# EAGLE design stEEG (EAGLE 9.3.0)

## Sheet 1 of 2
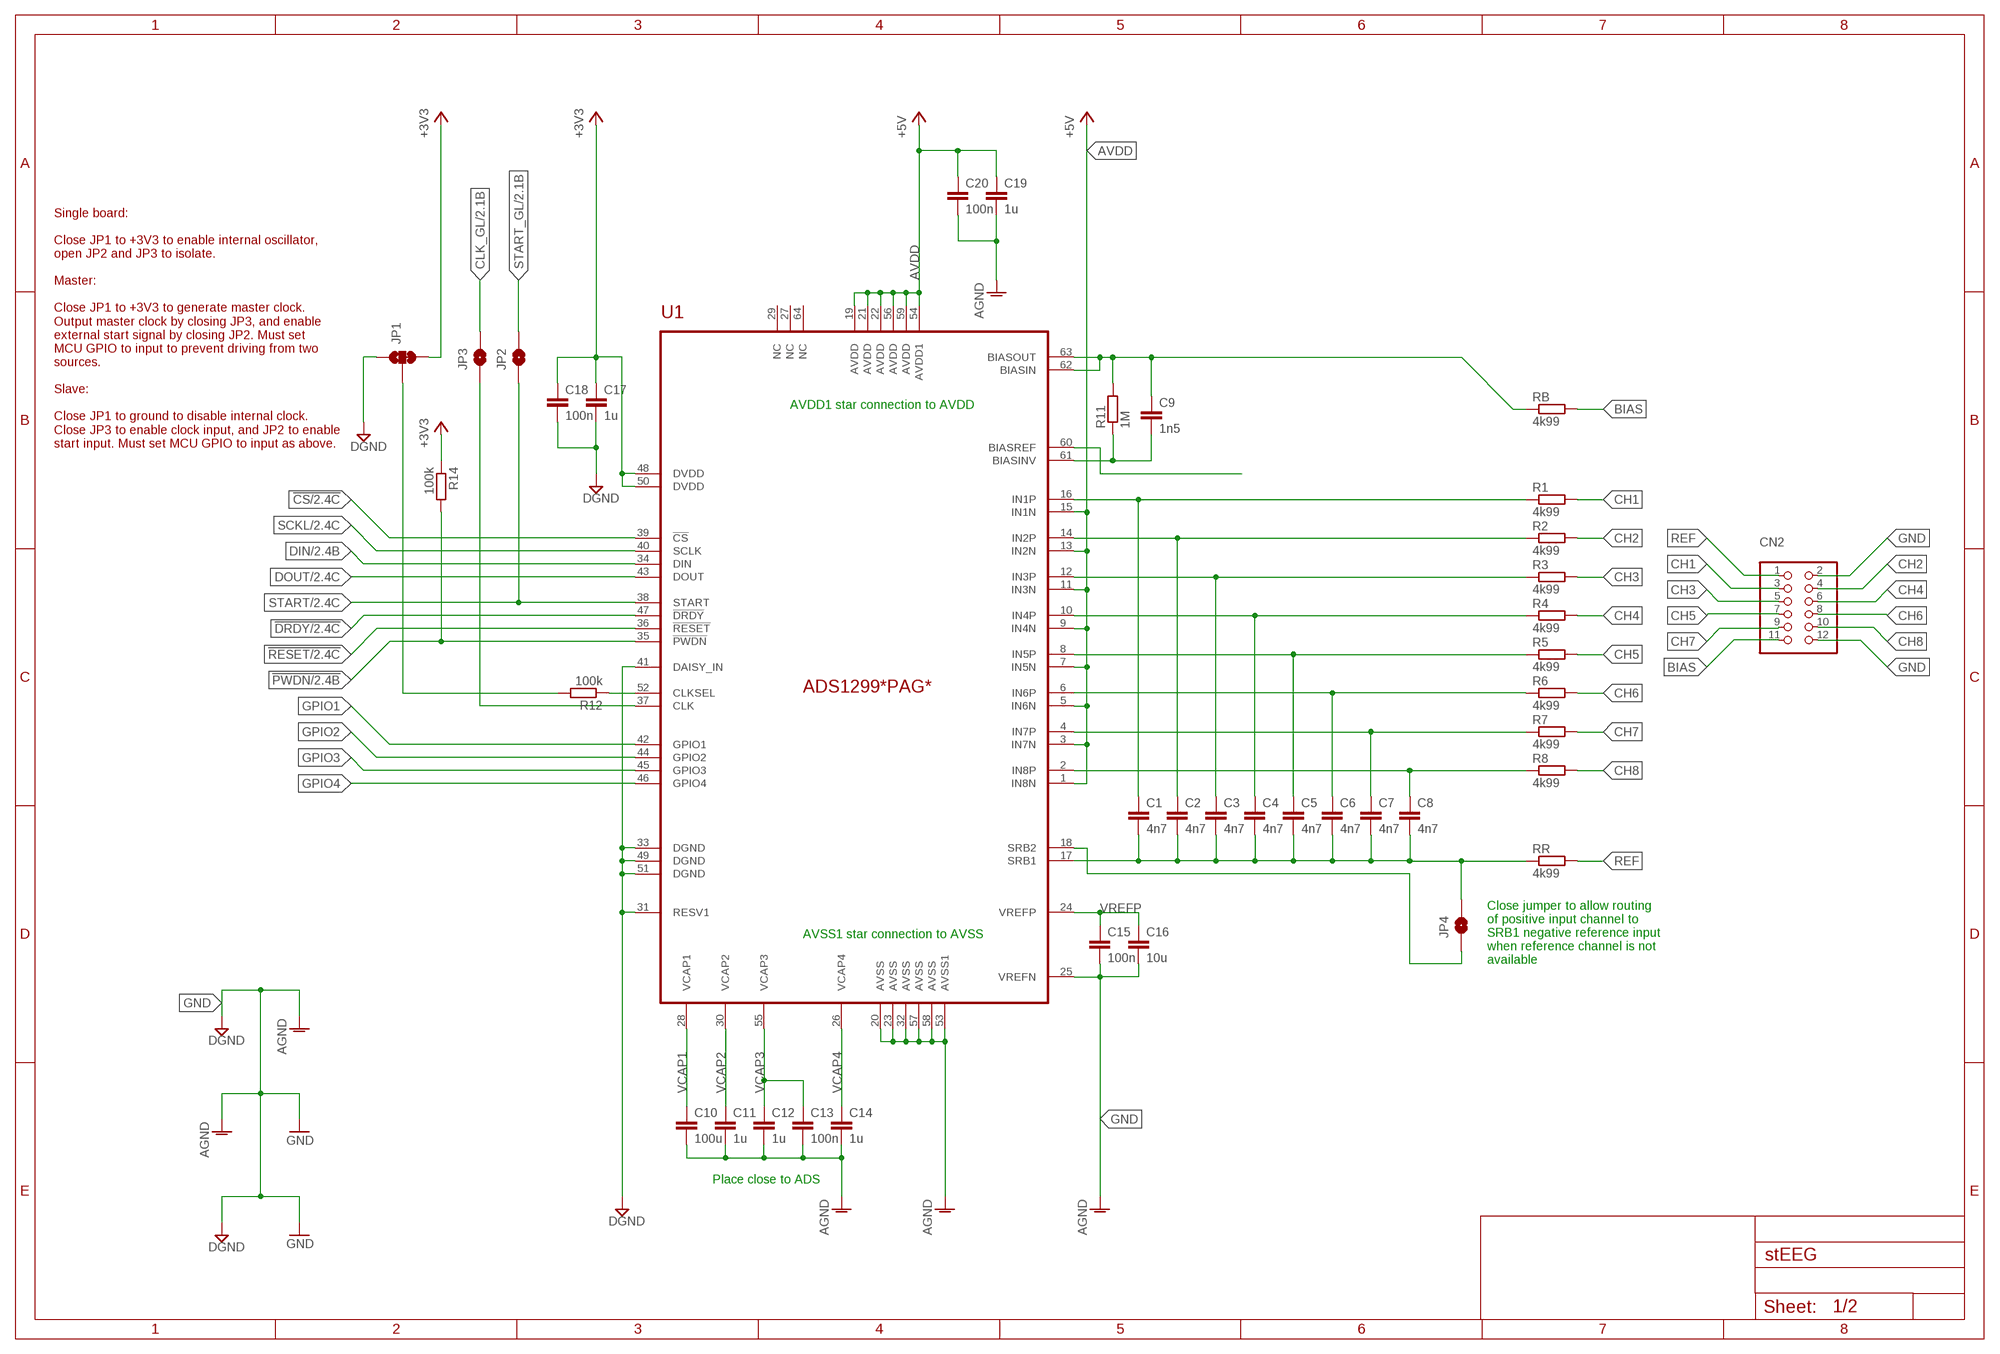
[diagram p0: schematic, sheet 1]

### Parts
C1  4n7  C-EUC0402  [C0402]
C2  4n7  C-EUC0402  [C0402]
C3  4n7  C-EUC0402  [C0402]
C4  4n7  C-EUC0402  [C0402]
C5  4n7  C-EUC0402  [C0402]
C6  4n7  C-EUC0402  [C0402]
C7  4n7  C-EUC0402  [C0402]
C8  4n7  C-EUC0402  [C0402]
C9  1n5  C-EUC0402  [C0402]
C10  100u  C-EUC1206  [C1206]
C11  1u  C-EUC0603  [C0603]
C12  1u  C-EUC0603  [C0603]
C13  100n  C-EUC0402  [C0402]
C14  1u  C-EUC0603  [C0603]
C15  100n  C-EUC0402  [C0402]
C16  10u  C-EUC0603  [C0603]
C17  1u  C-EUC0603  [C0603]
C18  100n  C-EUC0402  [C0402]
C19  1u  C-EUC0603  [C0603]
C20  100n  C-EUC0402  [C0402]
CN2  PINHD-2X6/90  [2X06/90]
JP1  JUMPER-SMT_3_1-NC_TRACE_SILK  [SMT-JUMPER_3_1-NC_TRACE_SILK]
JP2  JUMPER-SMT_2_NO_SILK  [SMT-JUMPER_2_NO_SILK]
JP3  JUMPER-SMT_2_NO_SILK  [SMT-JUMPER_2_NO_SILK]
JP4  JUMPER-SMT_2_NO_SILK  [SMT-JUMPER_2_NO_SILK]
R1  4k99  R-EU_R0402  [R0402]
R2  4k99  R-EU_R0402  [R0402]
R3  4k99  R-EU_R0402  [R0402]
R4  4k99  R-EU_R0402  [R0402]
R5  4k99  R-EU_R0402  [R0402]
R6  4k99  R-EU_R0402  [R0402]
R7  4k99  R-EU_R0402  [R0402]
R8  4k99  R-EU_R0402  [R0402]
R11  1M  R-EU_R0402  [R0402]
R12  100k  R-EU_R0402  [R0402]
R14  100k  R-EU_R0402  [R0402]
RB  4k99  R-EU_R0402  [R0402]
RR  4k99  R-EU_R0402  [R0402]
U1  ADS1299*PAG*  [PAG-PQFP64]

### Nets
!CS: U1.39(!CS) ; also sheet 2
!DRDY: U1.47(!DRDY) ; also sheet 2
!PWDN: R14.2 U1.35(!PWDN) ; also sheet 2
!RESET: U1.36(!RESET) ; also sheet 2
+3V3: C17.1 C18.1 JP1.3 R14.1 U1.48(DVDD) U1.50(DVDD) ; also sheet 2
AVDD: C19.1 C20.1 U1.1(IN8N) U1.3(IN7N) U1.5(IN6N) U1.7(IN5N) U1.9(IN4N) U1.11(IN3N) U1.13(IN2N) U1.15(IN1N) U1.19(AVDD) U1.21(AVDD) U1.22(AVDD) U1.54(AVDD1) U1.56(AVDD) U1.59(AVDD) ; supply symbol labelled +5V ; also sheet 2
BIAS: CN2.11 RB.2
CH1: CN2.3 R1.2
CH2: CN2.4 R2.2
CH3: CN2.5 R3.2
CH4: CN2.6 R4.2
CH5: CN2.7 R5.2
CH6: CN2.8 R6.2
CH7: CN2.9 R7.2
CH8: CN2.10 R8.2
CLK_GL: JP3.2 ; also sheet 2
DIN: U1.34(DIN) ; also sheet 2
DOUT: U1.43(DOUT) ; also sheet 2
GND: C10.2 C11.2 C12.2 C13.2 C14.2 C15.2 C16.2 C17.2 C18.2 C19.2 C20.2 CN2.2 CN2.12 JP1.1 U1.20(AVSS) U1.23(AVSS) U1.25(VREFN) U1.31(RESV1) U1.32(AVSS) U1.33(DGND) U1.41(DAISY_IN) U1.49(DGND) U1.51(DGND) U1.53(AVSS1) U1.57(AVSS) U1.58(AVSS) ; supply symbol labelled DGND, AGND ; also sheet 2
GPIO1: U1.42(GPIO1)
GPIO2: U1.44(GPIO2)
GPIO3: U1.45(GPIO3)
GPIO4: U1.46(GPIO4)
N$1: C1.1 R1.1 U1.16(IN1P)
N$2: R12.1 U1.52(CLKSEL)
N$3: C3.1 R3.1 U1.12(IN3P)
N$4: C4.1 R4.1 U1.10(IN4P)
N$5: C9.2 R11.1 U1.61(BIASINV)
N$6: C6.1 R6.1 U1.6(IN6P)
N$7: C7.1 R7.1 U1.4(IN7P)
N$10: C9.1 R11.2 RB.1 U1.62(BIASIN) U1.63(BIASOUT)
N$11: C2.1 R2.1 U1.14(IN2P)
N$14: C5.1 R5.1 U1.8(IN5P)
N$17: C8.1 R8.1 U1.2(IN8P)
N$19: U1.60(BIASREF)
N$20: JP4.1 U1.18(SRB2)
N$21: JP1.2 R12.2
N$22: JP3.1 U1.37(CLK)
REF: CN2.1 RR.2
SCKL: U1.40(SCLK) ; also sheet 2
START: JP2.1 U1.38(START) ; also sheet 2
START_GL: JP2.2 ; also sheet 2
VCAP1: C10.1 U1.28(VCAP1)
VCAP2: C11.1 U1.30(VCAP2)
VCAP3: C12.1 C13.1 U1.55(VCAP3)
VCAP4: C14.1 U1.26(VCAP4)
VREFP: C15.1 C16.1 U1.24(VREFP)
VREFX: C1.2 C2.2 C3.2 C4.2 C5.2 C6.2 C7.2 C8.2 JP4.2 RR.1 U1.17(SRB1)
Unconnected: U1.27(NC) U1.29(NC) U1.64(NC)

### Notes on the sheet
- AVDD1 star connection to AVDD
- Single board:
  
  Close JP1 to +3V3 to enable internal oscillator,
  open JP2 and JP3 to isolate.
  
  Master:
  
  Close JP1 to +3V3 to generate master clock. 
  Output master clock by closing JP3, and enable
  external start signal by closing JP2. Must set
  MCU GPIO to input to prevent driving from two
  sources.
  
  Slave:
  
  Close JP1 to ground to disable internal clock.
  Close JP3 to enable clock input, and JP2 to enable
  start input. Must set MCU GPIO to input as above.
- AVSS1 star connection to AVSS
- Close jumper to allow routing
  of positive input channel to
  SRB1 negative reference input
  when reference channel is not
  available
- Place close to ADS

## Sheet 2 of 2
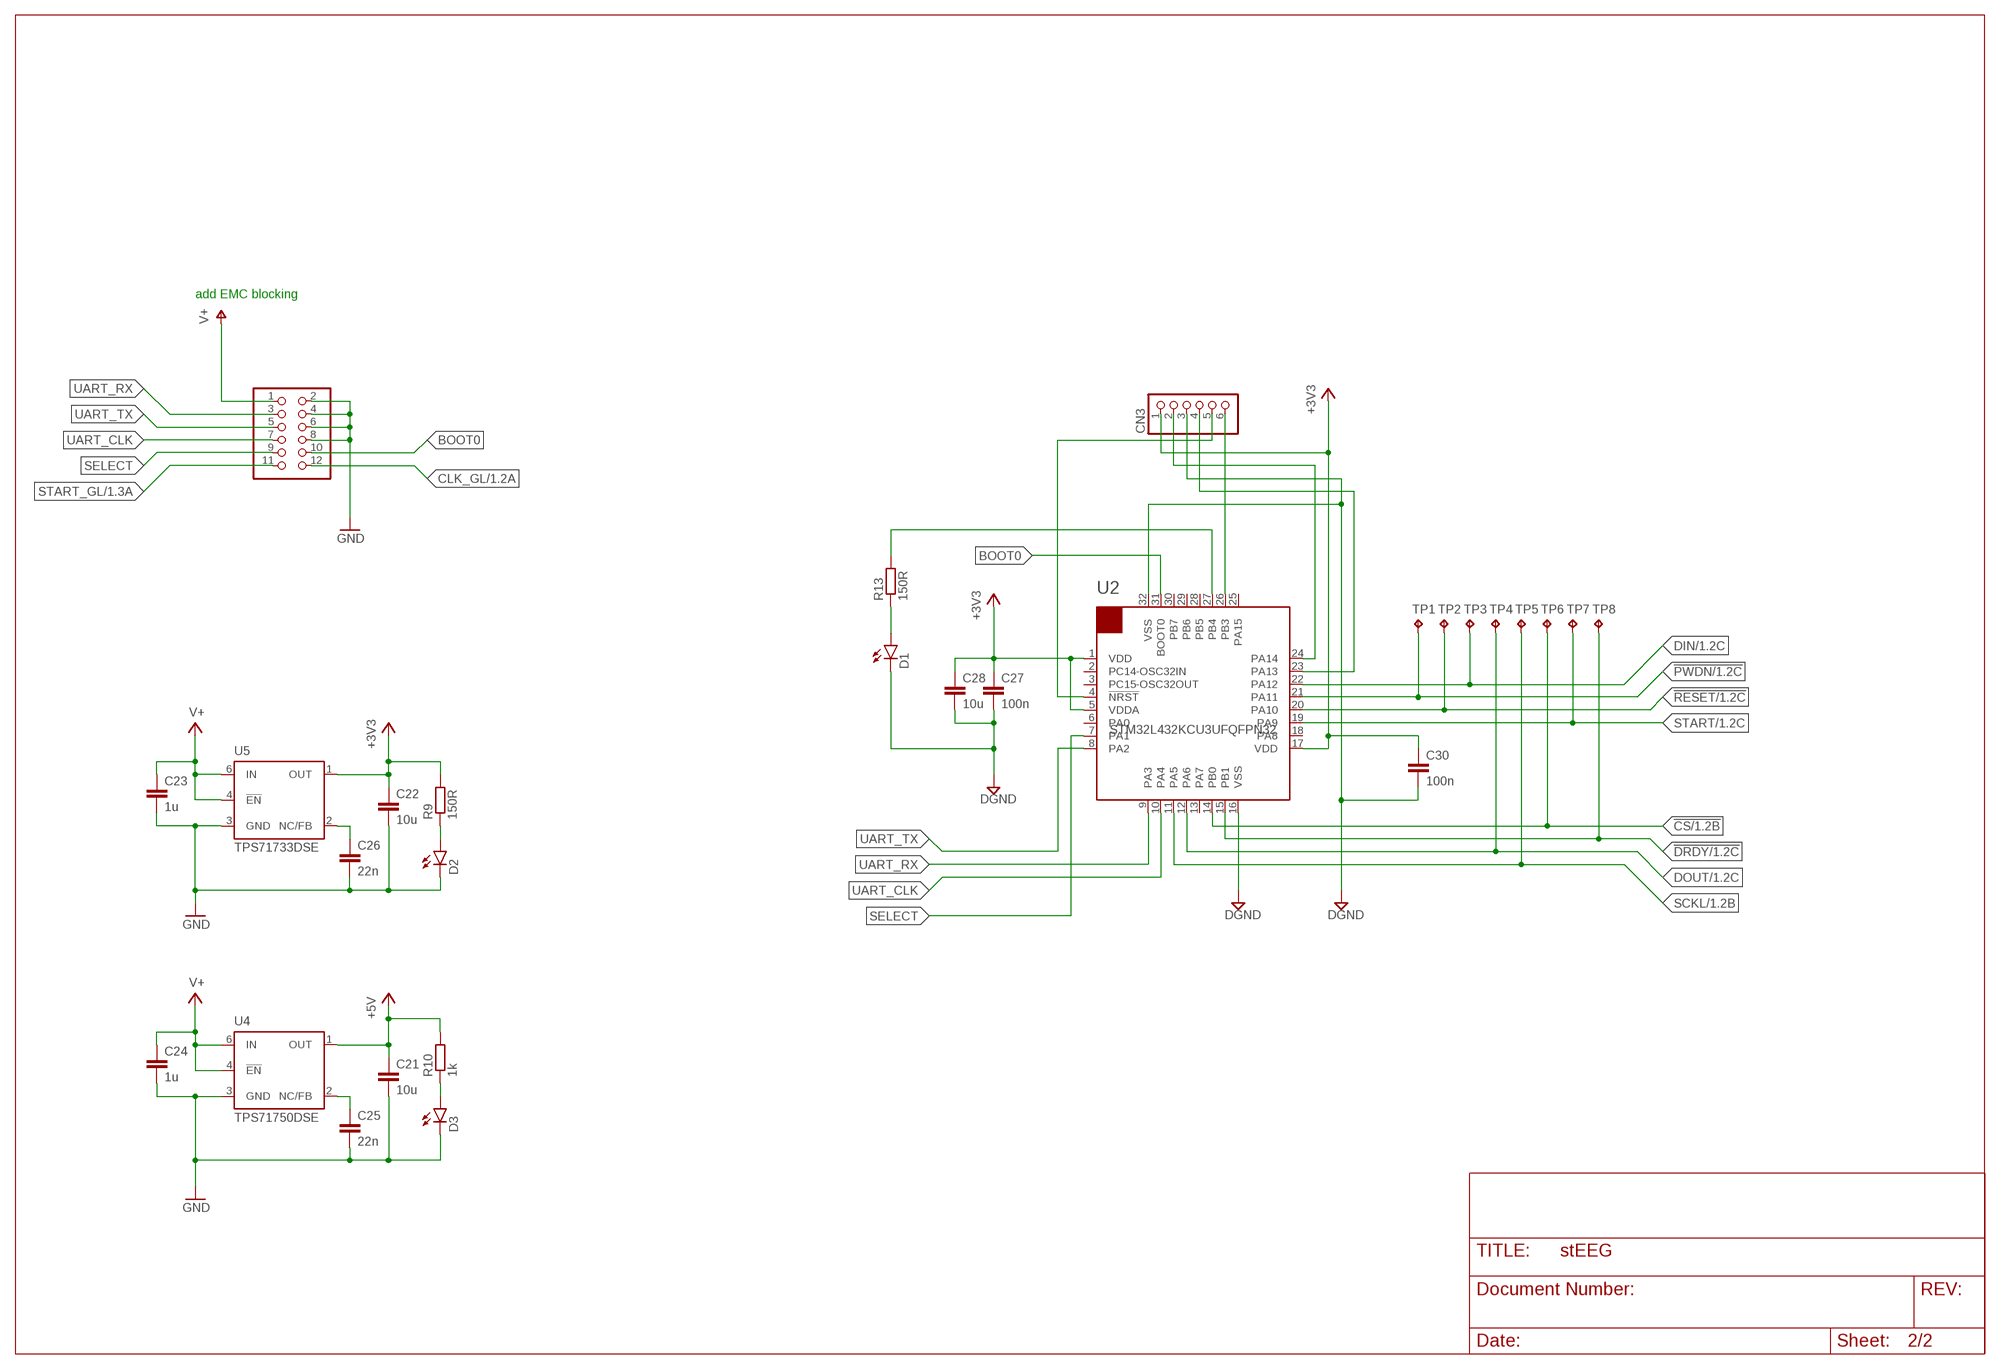
[diagram p1: schematic, sheet 2]

### Parts
C21  10u  C-EUC0805  [C0805]
C22  10u  C-EUC0805  [C0805]
C23  1u  C-EUC0603  [C0603]
C24  1u  C-EUC0603  [C0603]
C25  22n  C-EUC0402  [C0402]
C26  22n  C-EUC0402  [C0402]
C27  100n  C-EUC0402  [C0402]
C28  10u  C-EUC0603  [C0603]
C30  100n  C-EUC0402  [C0402]
CN1  PINHD-2X6/90  [2X06/90]
CN3  PINHD-1X6  [1X06]
D1  LED0603  [CHIP-LED0603]
D2  LED0603  [CHIP-LED0603]
D3  LED0603  [CHIP-LED0603]
R9  150R  R-EU_R0402  [R0402]
R10  1k  R-EU_R0402  [R0402]
R13  150R  R-EU_R0402  [R0402]
TP1  TPTP10R  [TP10R]
TP2  TPTP10R  [TP10R]
TP3  TPTP10R  [TP10R]
TP4  TPTP10R  [TP10R]
TP5  TPTP10R  [TP10R]
TP6  TPTP10R  [TP10R]
TP7  TPTP10R  [TP10R]
TP8  TPTP10R  [TP10R]
U2  STM32L432KCU3UFQFPN32  [QFN50P500X500X60-32]
U4  TPS71750DSE  [WSON-DSE]
U5  TPS71733DSE  [WSON-DSE]

### Nets
!CS: TP6.TP U2.14(PB0) ; also sheet 1
!DRDY: TP8.TP U2.15(PB1) ; also sheet 1
!PWDN: TP1.TP U2.21(PA11) ; also sheet 1
!RESET: TP2.TP U2.20(PA10) ; also sheet 1
+3V3: C22.1 C27.1 C28.1 C30.1 CN3.1 R9.2 U2.1(VDD) U2.5(VDDA) U2.17(VDD) U5.1(OUT) ; also sheet 1
AVDD: C21.1 R10.2 U4.1(OUT) ; supply symbol labelled +5V ; also sheet 1
BOOT0: CN1.10 U2.31(BOOT0)
CLK_GL: CN1.12 ; also sheet 1
DIN: TP3.TP U2.22(PA12) ; also sheet 1
DOUT: TP4.TP U2.12(PA6) ; also sheet 1
GND: C21.2 C22.2 C23.2 C24.2 C25.2 C26.2 C27.2 C28.2 C30.2 CN1.2 CN1.4 CN1.6 CN1.8 CN3.3 D1.C D2.C D3.C U2.16(VSS) U2.32(VSS) U4.3(GND) U5.3(GND) ; supply symbol labelled DGND ; also sheet 1
N$9: D1.A R13.1
N$12: CN3.4 U2.23(PA13)
N$13: C26.1 U5.2(NC/FB)
N$15: CN3.2 U2.24(PA14)
N$16: CN3.6 U2.26(PB3)
N$18: CN3.5 U2.4(!NRST)
N$23: D2.A R9.1
N$24: R13.2 U2.27(PB4)
N$26: D3.A R10.1
N$31: C25.1 U4.2(NC/FB)
SCKL: TP5.TP U2.11(PA5) ; also sheet 1
SELECT: CN1.9 U2.7(PA1)
START: TP7.TP U2.19(PA9) ; also sheet 1
START_GL: CN1.11 ; also sheet 1
UART_CLK: CN1.7 U2.10(PA4)
UART_RX: CN1.3 U2.9(PA3)
UART_TX: CN1.5 U2.8(PA2)
V+: C23.1 C24.1 CN1.1 U4.4(!EN) U4.6(IN) U5.4(!EN) U5.6(IN)
Unconnected: U2.2(PC14-OSC32IN) U2.3(PC15-OSC32OUT) U2.6(PA0) U2.13(PA7) U2.18(PA8) U2.25(PA15) U2.28(PB5) U2.29(PB6) U2.30(PB7)

### Notes on the sheet
- add EMC blocking

## Library data of the parts
C1-C28 C30 = rclc:C-EU: CAPACITOR, European symbol; SPICEPREFIX: C
CN1 CN2 = pinhead:PINHD-2X6: PIN HEADER
CN3 = pinhead:PINHD-1X6: PIN HEADER
D1-D3 = LED:LED: LED OSRAM: - CHIPLED LG R971, LG N971, LY N971, LG Q971, LY Q971, LO R971, LY R971 LH N974, LH R974 LS Q976, LO Q976, LY Q976 LO Q996 - Hyper CHIPLED LW Q18S LB Q993, LB Q99A, LB R99A - SideLED LS A670, LO A670, LY A670, LG A670, LP A670 LB A673, LV A673, LT A673, LW A673 LH A674 LY A675 LS A676, LA A676, LO A676, LY A676, LW A676 LS A679, LY A679, LG A679 - Hyper Micro SIDELED® LS Y876, LA Y876, LO Y876, LY Y876 LT Y87S - SmartLED LW L88C, LW L88S LB L89C, LB L89S, LG L890 LS L89K, LO L89K, LY L89K LS L896, LA L896, LO L896, LY L896 - TOPLED LS T670, LO T670, LY T670, LG T670, LP T670 LSG T670, LSP T670, LSY T670, LOP T670, LYG T670 LG T671, LOG T671, LSG T671 LB T673, LV T673, LT T673, LW T673 LH T674 LS T676, LA T676, LO T676, LY T676, LB T676, LH T676, LSB T676, LW T676 LB T67C, LV T67C, LT T67C, LS T67K, LO T67K, LY T67K, LW E67C LS E67B, LA E67B, LO E67B, LY E67B, LB E67C, LV E67C, LT E67C LW T67C LS T679, LY T679, LG T679 LS T770, LO T770, LY T770, LG T770, LP T770 LB T773, LV T773, LT T773, LW T773 LH T774 LS E675, LA E675, LY E675, LS T675 LS T776, LA T776, LO T776, LY T776, LB T776 LHGB T686 LT T68C, LB T68C - Hyper Mini TOPLED® LB M676 - Mini TOPLED Santana® LG M470 LS M47K, LO M47K, LY M47K Source: http://www.osram.convergy.de LUXEON: - LUMILED® LXK2-PW12-R00, LXK2-PW12-S00, LXK2-PW14-U00, LXK2-PW14-V00 LXK2-PM12-R00, LXK2-PM12-S00, LXK2-PM14-U00 LXK2-PE12-Q00, LXK2-PE12-R00, LXK2-PE12-S00, LXK2-PE14-T00, LXK2-PE14-U00 LXK2-PB12-K00, LXK2-PB12-L00, LXK2-PB12-M00, LXK2-PB14-N00, LXK2-PB14-P00, LXK2-PB14-Q00 LXK2-PR12-L00, LXK2-PR12-M00, LXK2-PR14-Q00, LXK2-PR14-R00 LXK2-PD12-Q00, LXK2-PD12-R00, LXK2-PD12-S00 LXK2-PH12-R00, LXK2-PH12-S00 LXK2-PL12-P00, LXK2-PL12-Q00, LXK2-PL12-R00 Source: www.luxeon.com KINGBRIGHT: KA-3528ASYC Source: www.kingbright.com
JP1 = JumpSMD:JUMPER-SMT_3_1-NC_TRACE: Normally closed trace jumper (1 of 2 connections) This jumper has a trace between two pads so it's normally closed (NC). The other connection is normally open (NO). Use a razor knife to open the connection. For best results follow the IPC guidelines for cutting traces: Cutout at least 0.063 mm (0.005 in). Remove all loose material to clean up the cut area. Seal the cut with an approved epoxy. Reapply solder to reclose the connection, or to close the NO connection.
JP2-JP4 = JumpSMD:JUMPER-SMT_2_NO: Normally open jumper This jumper has two pads in close proximity to each other. Apply solder to close the connection. Round pads are easier to solder for beginners, but are a lot larger. SparkFun Product that uses the round pads: SparkFun EL Sequencer <https://www.sparkfun.com/products/12781>
R1-R14 RB RR = rclc:R-EU_: RESISTOR, European symbol; SPICEPREFIX: R
TP1-TP8 = testpad:TP: Test pad
U1 = ADS129x:ADS1299: 8-Channel, 24-Bit Analog-To-Digital Converter With Integrated EEG Front End. ADS1299 modifications by Adam Feuer (adam@adamfeuer.com) Based on ADS1298: Drawn 23.07.2011 by Tomasz Boleslaw CEDRO (http://www.tomek.cedro.info).
U2 = STM32:STM32L432KCU3
U4 U5 = TPS717xx:TPS717*: TPS717 Low-Noise, High-Bandwidth PSRR, Low-Dropout, 150-mA Linear Regulator 150-mA Low-Dropout Regulator Source: http://www.ti.com/lit/ds/symlink/tps717.pdf

## Board
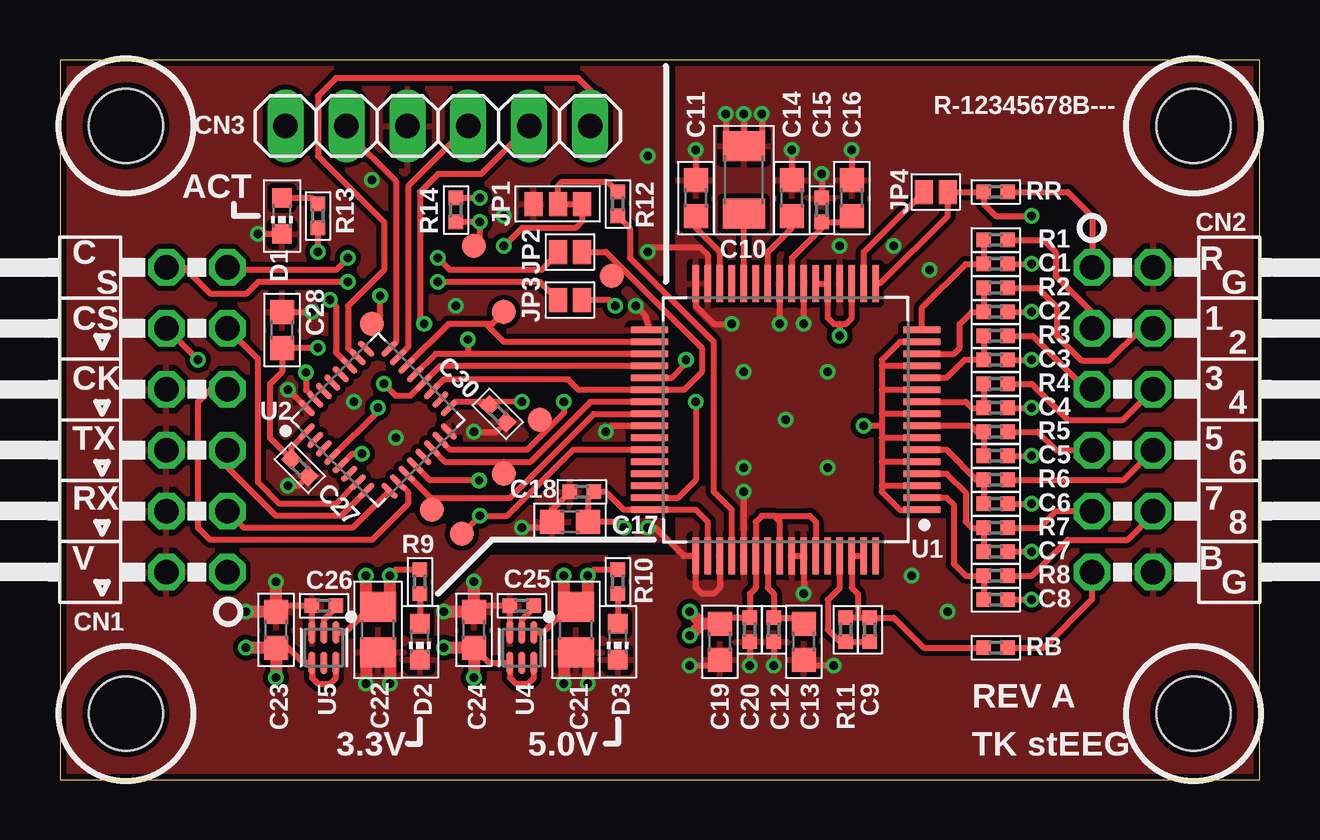
[diagram p2: board, top side]
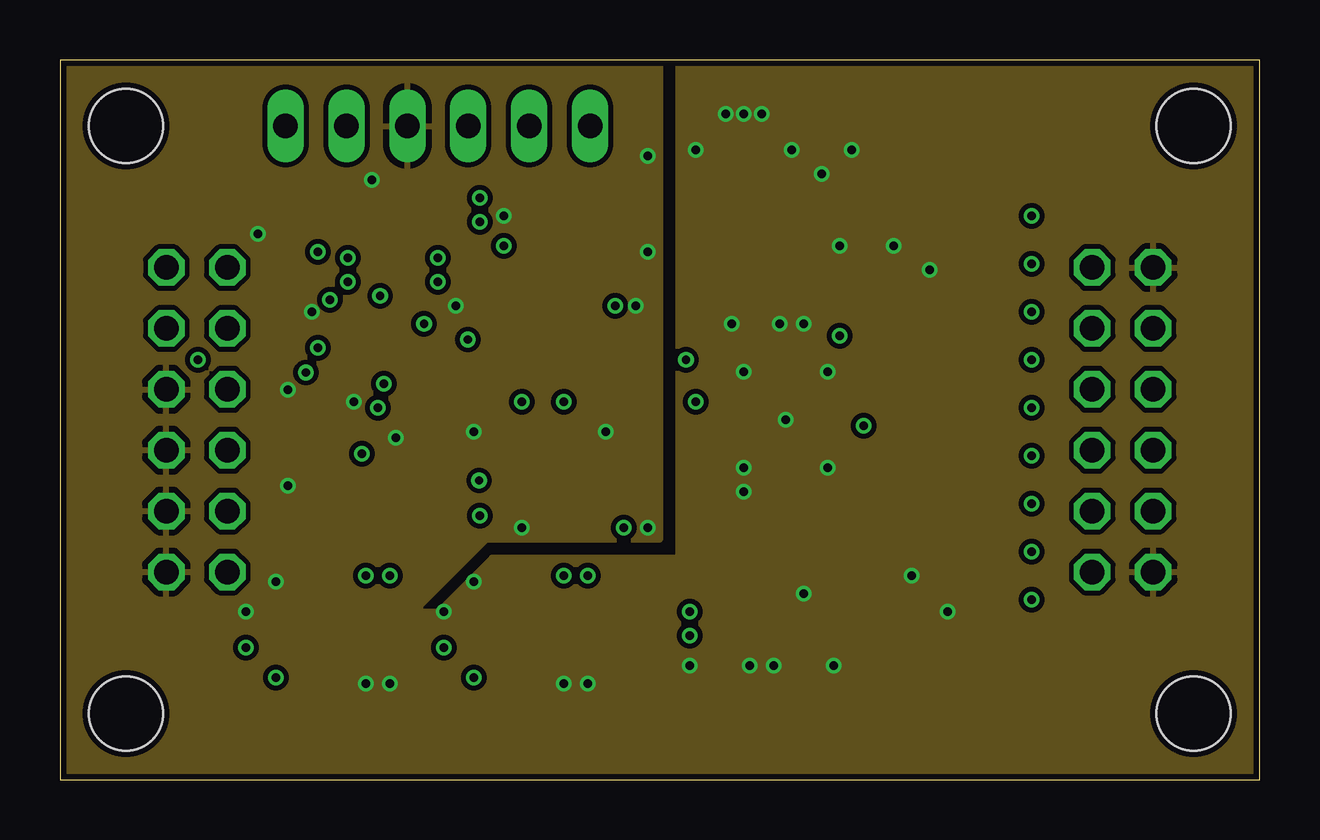
[diagram p3: board, inner layer Route2]
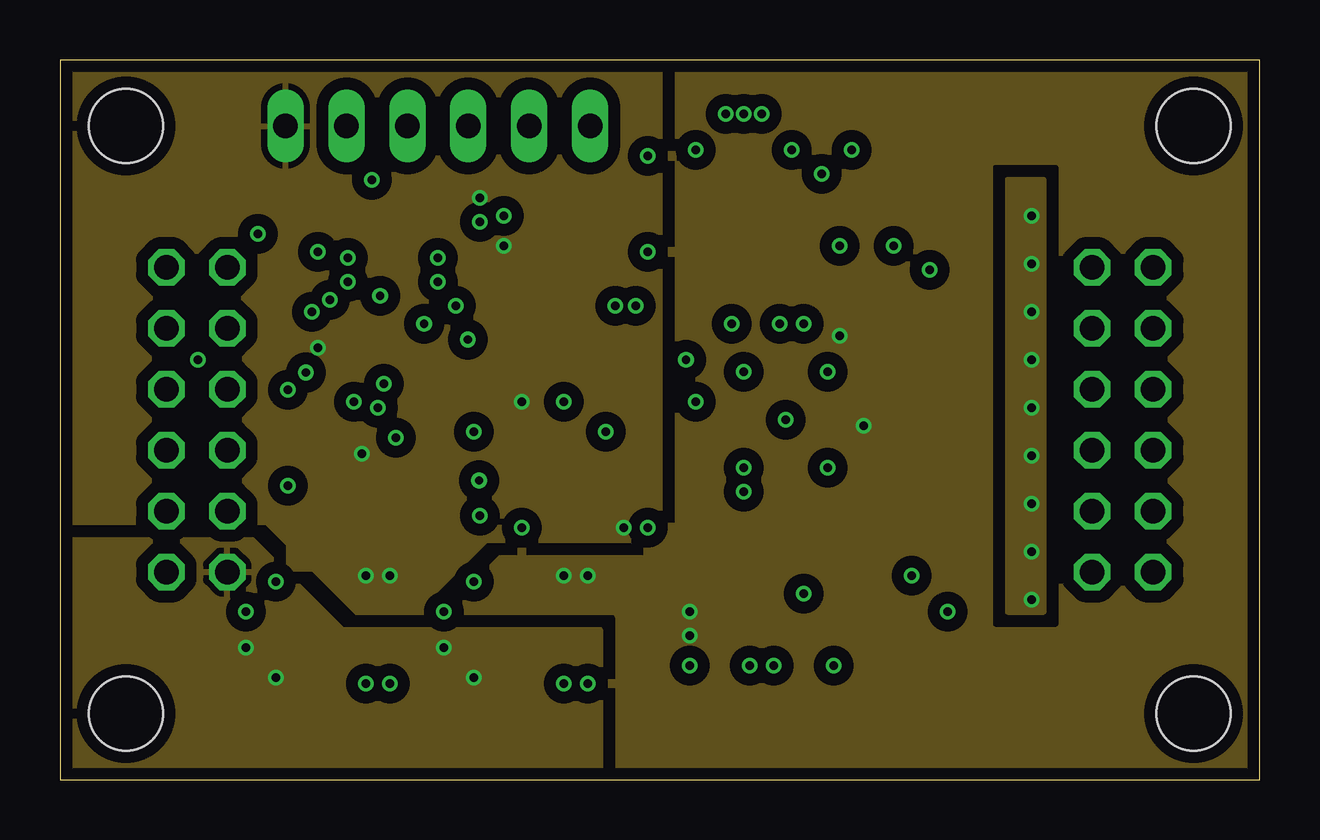
[diagram p4: board, inner layer Route15]
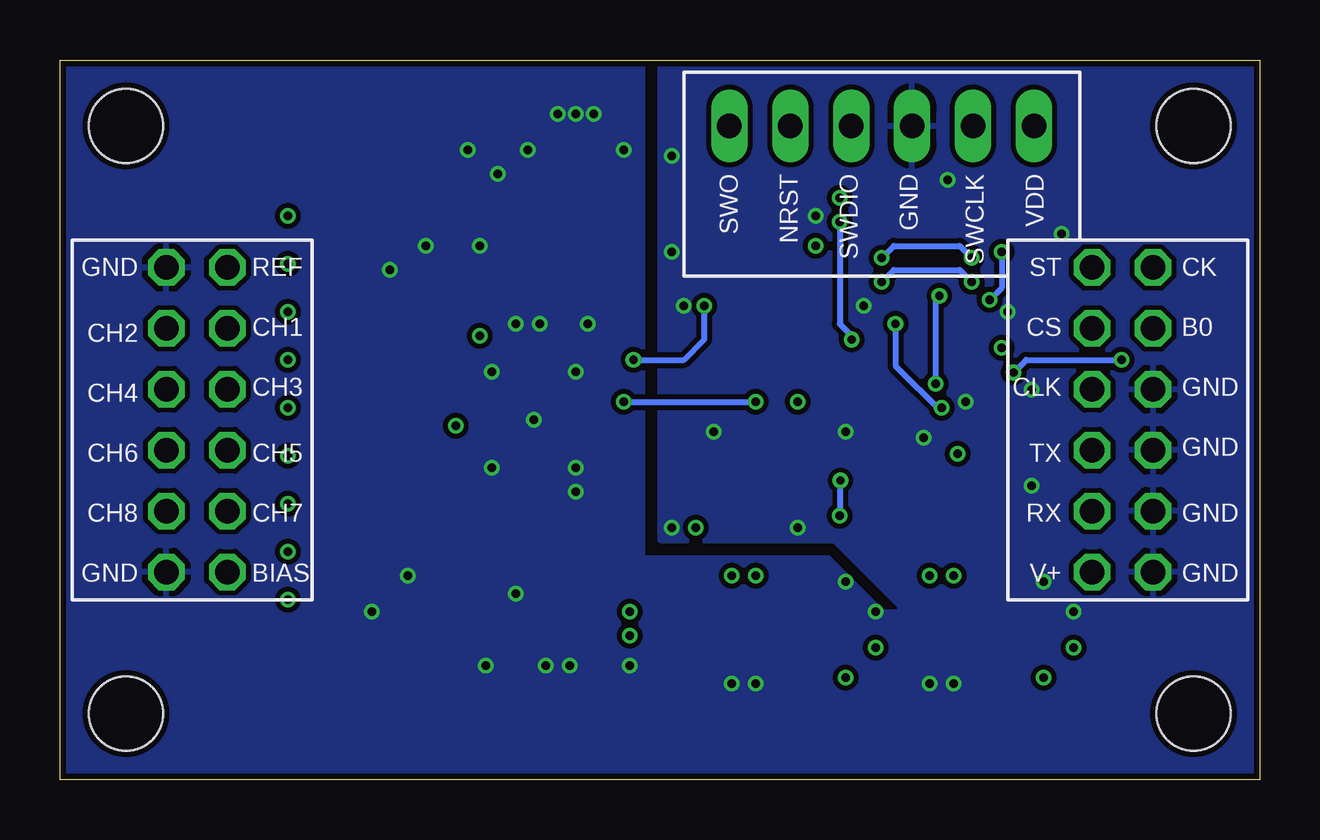
[diagram p5: board, bottom side, seen from below]

Size 50 x 30 mm. Coordinates in mm from the lower left corner, seen from the top.
Outline: 0,0 50,0 50,30 0,30 0,0
Copper layers (1+2*15+16): Top 0.035mm / dielectric 1.5mm / Route2 0.035mm / dielectric 0.15mm / Route15 0.035mm / dielectric 0.2mm / Bottom 0.035mm
Design rules "default *": minimum track width 8mil, minimum drill 0.3mm, track to track 8mil, track to pad 8mil, pad to pad 8mil, via to via 8mil, smd to smd 8mil, copper to edge 10mil, drill to drill 6mil, minimum pad ring 6mil, minimum via ring 6mil, stop-mask expansion 4mil, vias tented up to drill 35mil, thermal gap 10mil
Holes 3.1 mm at 2.75,27.25 2.75,2.75 47.25,2.75 47.25,27.25

### Footprints (pad centres in the part's own frame; a part is rotated, then mirrored left to right if it is on the bottom)
C0402 = smd 0.6 x 0.6: 1 -0.5,0; 2 0.5,0
C1206 = smd 1.25 x 1.75: 1 -1.4,0; 2 1.4,0
C0603 = smd 1 x 1: 1 -0.75,0; 2 0.75,0
C0805 = smd 1.25 x 1.5: 1 -0.95,0; 2 0.95,0
2X06/90 = drill 1.016 octagon: 1 -6.35,-6.35; 2 -6.35,-3.81; 3 -3.81,-6.35; 4 -3.81,-3.81; 5 -1.27,-6.35; 6 -1.27,-3.81; 7 1.27,-6.35; 8 1.27,-3.81; 9 3.81,-6.35; 10 3.81,-3.81; 11 6.35,-6.35; 12 6.35,-3.81
1X06 = drill 1.016 long: 1 -6.35,0; 2 -3.81,0; 3 -1.27,0; 4 1.27,0; 5 3.81,0; 6 6.35,0
CHIP-LED0603 = smd 0.8 x 0.8: A 0,-0.75; C 0,0.75
SMT-JUMPER_3_1-NC_TRACE_SILK = smd 0.75 x 1: 1 -1.016,0; 2 0,0; 3 1.016,0
SMT-JUMPER_2_NO_SILK = smd 0.75 x 1: 1 -0.5,0; 2 0.5,0
R0402 = smd 0.6 x 0.6: 1 -0.5,0; 2 0.5,0
TP10R = smd 1 x 1: TP 0,0
PAG-PQFP64 = smd 1.559 x 0.28: 1 -5.678,3.75; 2 -5.678,3.25; 3 -5.678,2.75; 4 -5.678,2.25; 5 -5.678,1.75; 6 -5.678,1.25; 7 -5.678,0.75; 8 -5.678,0.25; 9 -5.678,-0.25; 10 -5.678,-0.75; 11 -5.678,-1.25; 12 -5.678,-1.75; 13 -5.678,-2.25; 14 -5.678,-2.75; 15 -5.678,-3.25; 16 -5.678,-3.75; 33 5.678,-3.75; 34 5.678,-3.25; 35 5.678,-2.75; 36 5.678,-2.25; 37 5.678,-1.75; 38 5.678,-1.25; 39 5.678,-0.75; 40 5.678,-0.25; 41 5.678,0.25; 42 5.678,0.75; 43 5.678,1.25; 44 5.678,1.75; 45 5.678,2.25; 46 5.678,2.75; 47 5.678,3.25; 48 5.678,3.75 | smd 0.28 x 1.559: 17 -3.75,-5.678; 18 -3.25,-5.678; 19 -2.75,-5.678; 20 -2.25,-5.678; 21 -1.75,-5.678; 22 -1.25,-5.678; 23 -0.75,-5.678; 24 -0.25,-5.678; 25 0.25,-5.678; 26 0.75,-5.678; 27 1.25,-5.678; 28 1.75,-5.678; 29 2.25,-5.678; 30 2.75,-5.678; 31 3.25,-5.678; 32 3.75,-5.678; 49 3.75,5.678; 50 3.25,5.678; 51 2.75,5.678; 52 2.25,5.678; 53 1.75,5.678; 54 1.25,5.678; 55 0.75,5.678; 56 0.25,5.678; 57 -0.25,5.678; 58 -0.75,5.678; 59 -1.25,5.678; 60 -1.75,5.678; 61 -2.25,5.678; 62 -2.75,5.678; 63 -3.25,5.678; 64 -3.75,5.678
QFN50P500X500X60-32 = smd 0.86 x 0.25: 1 -2.435,1.75; 2 -2.435,1.25; 3 -2.435,0.75; 4 -2.435,0.25; 5 -2.435,-0.25; 6 -2.435,-0.75; 7 -2.435,-1.25; 8 -2.435,-1.75; 17 2.435,-1.75; 18 2.435,-1.25; 19 2.435,-0.75; 20 2.435,-0.25; 21 2.435,0.25; 22 2.435,0.75; 23 2.435,1.25; 24 2.435,1.75 | smd 0.25 x 0.86: 9 -1.75,-2.435; 10 -1.25,-2.435; 11 -0.75,-2.435; 12 -0.25,-2.435; 13 0.25,-2.435; 14 0.75,-2.435; 15 1.25,-2.435; 16 1.75,-2.435; 25 1.75,2.435; 26 1.25,2.435; 27 0.75,2.435; 28 0.25,2.435; 29 -0.25,2.435; 30 -0.75,2.435; 31 -1.25,2.435; 32 -1.75,2.435
WSON-DSE = smd 0.935 x 0.27: 1 -0.632,0.5; 2 -0.632,0; 3 -0.632,-0.5; 4 0.632,-0.5; 5 0.632,0; 6 0.632,0.5

### Placement (x,y rotation side)
C1  39,21.5 0 top
C2  39,19.5 0 top
C3  39,17.5 0 top
C4  39,15.5 0 top
C5  39,13.5 0 top
C6  39,11.5 0 top
C7  39,9.5 0 top
C8  39,7.5 0 top
C9  33.75,6.25 270 top
C10  28.5,25 90 top
C11  26.5,24.25 90 top
C12  31,5.75 270 top
C13  29.75,6.25 270 top
C14  30.5,24.25 90 top
C15  31.75,23.75 90 top
C16  33,24.25 90 top
C17  21.25,10.75 180 top
C18  21.75,12 180 top
C19  27.5,5.75 270 top
C20  28.75,6.25 270 top
C21  21.5,6.25 270 top
C22  13.25,6.25 270 top
C23  9,6.25 90 top
C24  17.25,6.25 90 top
C25  19.25,7.25 180 top
C26  11,7.25 180 top
C27  10,13 315 top
C28  9.25,18.75 90 top
C30  18.25,15.25 315 top
CN1  0.62,15 90 top
CN2  49.38,15 270 top
CN3  15.75,27.25 0 top
D1  9.25,23.5 180 top
D2  15,5.75 180 top
D3  23.25,5.75 180 top
JP1  20.75,24 0 top
JP2  21.25,22 180 top
JP3  21.25,20 180 top
JP4  36.5,24.5 0 top
R1  39,22.5 0 top
R2  39,20.5 0 top
R3  39,18.5 0 top
R4  39,16.5 0 top
R5  39,14.5 0 top
R6  39,12.5 0 top
R7  39,10.5 0 top
R8  39,8.5 0 top
R9  15,8.25 90 top
R10  23.25,8.25 90 top
R11  32.75,6.25 90 top
R12  23.25,24 90 top
R13  10.75,23.5 270 top
R14  16.5,23.75 270 top
RB  39,5.5 0 top
RR  39,24.5 0 top
TP1  17.25,22.25 0 top
TP2  13,19 0 top
TP3  18.5,19.5 0 top
TP4  16.75,10.25 0 top
TP5  15.5,11.25 0 top
TP6  18.5,12.75 0 top
TP7  23,21 0 top
TP8  20,15 0 top
U1  30.25,15 180 top
U2  13.25,15 45 top
U4  19.25,5.5 270 top
U5  11,5.5 270 top

### Tracks (layer width: path | path; a pad name or v marks a point on that pad's centre or on a via)
!CS
  Top 0.25: U2.14 16.06,13.25 18.5,13.25 | 18.5,13.25 19.61,13.25 22.11,15.75 U1.39 | TP6.TP 18.5,13.25
!DRDY  (via drill 0.35 pad 0.35)
  Top 0.25: U2.15 16.27,13.75 19.47,13.75 20.36,14.64 | U1.47 25.75,11.75 26.5,12.5 v26.5,15.75 | v21,15.75 21,15.28 20.36,14.64 | TP8.TP 20.36,14.64
  Bottom 0.25: v26.5,15.75 v21,15.75
!PWDN  (via drill 0.35 pad 0.35)
  Top 0.25: U2.21 15.65,17.75 17,17.75 | U1.35 17,17.75 | R14.2 v17.5,23.25 17.5,22.5 TP1.TP | v17,18.34 17,17.75
  Bottom 0.25: v17.5,23.25 17.5,19 17,18.5 v17,18.34
!RESET  (via drill 0.35)
  Top 0.25: U1.36 15.85,17.25 U2.20 14.6,16 14,16 v13.5,16.5 | v13.34,20.17 13.34,19.34 TP2.TP
  Bottom 0.25: v13.5,16.5 13.5,20.01 v13.34,20.17
+3V3  (via drill 0.35, 0.35 pad 0.35)
  Top 0.25: U1.50 27,10.75 26.5,11.25 U1.48 23.5,11.25 22.75,12 C18.1 22,11.75 C17.1 23.25,10.75 v23.5,10.5 | 17.86,15.75 C30.1 | v10.75,18 C28.1 9.25,17 8.75,16.5 8.75,14.25 C27.1 9.65,13.87 U2.1 | v19.25,15.75 18.04,15.75 C30.1 | C30.1 17.75,15.75 16.48,15.75 U2.17 | U5.1 11.88,6.13 12.95,7.2 C22.1 | R9.2 14,8.75 v13.75,8.5 | v17.5,24.25 R14.1 | JP1.3 21.77,23.27 21.5,23 19.25,23 v18.5,22.25 | U2.5 12.19,13.58 v12.58,13.58
  Top 0.5: v12.75,8.5 12.75,7.7 C22.1 13.75,7.7 v13.75,8.5
  pour Route15 (isolate 0.5, rank 2): 0,0 15.5,0 15.5,7.75 17.75,10 25,10 25,30 0,30
AVDD  (via drill 0.35 pad 0.35)
  Top 0.25: U1.56 30,10.75 29.75,11 | 29.75,11 29.25,11 29,10.75 U1.54 29,8 28.75,7.75 C20.1 27.75,6.75 C19.1 | 29.75,11 31.25,11 31.5,10.75 U1.59 | U1.22 U1.21 32,19.25 32.25,19 32.5,19 | 32.5,19 32.75,19 33,19.25 U1.19 | U1.15 35,18.25 34.25,17.5 34.25,17.25 | U1.1 35,11.25 34.25,12 34.25,12.25 | 34.25,14.25 34.25,13.25 | 34.25,13.25 34.25,12.25 | U1.7 34.25,14.25 | U1.3 34.25,12.25 | U1.13 34.25,17.25 | 34.25,17.25 34.25,16.25 | 34.25,16.25 34.25,15.25 | 34.25,15.25 34.25,14.75 | 34.25,14.75 34.25,14.25 | U1.11 34.25,16.25 | U1.9 34.25,15.25 | U1.5 34.25,13.25 | U4.1 20.13,6.13 21.2,7.2 C21.1 | R10.2 22.25,8.75 v22,8.5 | 32.5,19 v32.5,18.5 | 34.25,14.75 v33.5,14.75
  Top 0.5: v21,8.5 21,7.7 C21.1 22,7.7 v22,8.5 | C19.1 26.75,6.5 | 26.75,6.5 v26.25,6 | 26.75,6.5 v26.25,7
  pour Route15 (isolate 0.5, rank 4): 0,30 50,30 50,0 0,0
BIAS
  Top 0.25: RB.2 41,5.5 43.02,7.53 CN2.11
BOOT0  (via drill 0.35 pad 0.35)
  Top 0.25: U2.31 10.25,16.23 v10.25,16.97 | v5.75,17.5 CN1.10
  Bottom 0.25: v10.25,16.97 9.72,17.5 v5.75,17.5
CH1
  Top 0.25: CN2.3 43.02,19.48 41.5,21 41.5,22 41,22.5 R1.2
CH2
  Top 0.25: R2.2 40.75,20.5 41.55,19.7 41.55,18.5 42.57,17.47 43.73,17.47 45.07,18.81 CN2.4
CH3
  Top 0.25: R3.2 40.55,18.5 42.77,16.27 CN2.5
CH4
  Top 0.25: R4.2 40.5,16.5 42,15 44.3,15 CN2.6
CH5
  Top 0.25: R5.2 40.76,14.5 41.52,13.73 CN2.7
CH6
  Top 0.25: R6.2 44.34,12.5 CN2.8
CH7
  Top 0.25: R7.2 40.84,10.5 41.52,11.19 CN2.9
CH8
  Top 0.25: CN2.10 45.56,11.06 44.5,10 42,10 40.5,8.5 R8.2
CLK_GL  (via drill 0.35 pad 0.35)
  Top 0.25: JP3.2 20,20.75 v15.75,20.75 | v12,20.75 8.25,20.75 7.75,20.25 6.29,20.25 5.18,21.35 CN1.12
  Bottom 0.25: v12,20.75 12.5,21.25 15.25,21.25 v15.75,20.75
DIN
  Top 0.25: U2.22 16.19,19 17.5,19 17.75,19 | U1.34 18.5,18.25 17.75,19 | TP3.TP 18,19 17.75,19
DOUT  (via drill 0.35 pad 0.35)
  Top 0.25: U1.43 21.39,13.75 18.64,11 v17.5,11 TP4.TP | v17.47,12.47 15.43,12.47 U2.12
  Bottom 0.25: v17.47,12.47 17.5,12.44 v17.5,11
GND  (via drill 0.35, 0.35 pad 0.35)
  Top 0.25: U5.3 C26.2 9.25,7.25 C23.2 | C24.2 17.5,7.25 C25.2 U4.3 | U1.57 U1.58 v31,7.75 | U1.53 v28.5,12 | C13.2 v29.75,4.75 | C19.2 27.25,4.75 v26.25,4.75 | v32.25,4.75 31.25,4.75 C12.2 | v26.5,26.25 C11.2 | v27.75,27.75 27.75,26.9 28.2,26.45 28.5,26.75 v28.5,27.75 | v29.25,27.75 29.25,27 28.65,26.4 C10.2 | v30.5,26.25 C14.2 | v31.75,25.25 C15.2 | v33,26.25 C16.2 | v30,19 U1.25 | v31,19 U1.23 | U1.32 26.5,19.75 27.25,19 v28,19 | C20.2 v28.75,4.75 | U1.33 24.4,19.35 v24,19.75 | v19.25,10.5 20.25,10.5 C17.2 20.5,11.25 C18.2 | U1.41 23,14.75 v22.75,14.5 | v24.5,10.5 24.82,10.5 26,9.32 U1.49 26.5,8 26.75,7.75 27.25,7.75 27.5,8 U1.51 | v24.5,22 24.68,22.18 26.68,22.18 27,21.86 U1.31 | C30.2 18.21,14.5 v17.25,14.5 | U2.32 9.53,16.25 v9.5,16.25 | D1.C v8.25,22.75 | C28.2 v10.5,19.5 | C27.2 9.96,12.25 v9.5,12.25
  Top 0.5: v9,8.25 C23.2 v7.75,7 | v12.75,4 12.75,4.8 C22.2 13.75,4.8 v13.75,4 | v21,4 21,4.8 C21.2 22,4.8 v22,4 | v17.25,8.25 C24.2 v16,7
  other vias: 37,7 35.5,8.5 30.25,15 32,17 28.5,17 28.5,13 32,13 36.25,21.25 14,14.25 12.25,15.75 18.5,23.5 24.5,26 32.5,22.25 34.75,22.25 16.5,19.75 13,25
  pour Top: 0,30 25,30 25,10 17.75,10 15,7.25 15,0 0,0
  pour Top: 25.75,30 25.75,9.25 18,9.25 15.75,7 15,7 15,0 50,0 50,30
  pour Bottom: 25.75,30 25.75,9.25 18,9.25 15.75,7 15,7 15,0 50,0 50,30
  pour Bottom: 0,30 25,30 25,10 17.75,10 15,7.25 15,0 0,0
  pour Route2: 25.75,30 25.75,9.25 18,9.25 15.75,7 15,7 15,0 50,0 50,30
  pour Route2: 0,30 25,30 25,10 17.75,10 15,7.25 15,0 0,0
N$1
  Top 0.25: R1.1 C1.1 37.75,21.5 35.93,19.68 U1.16
N$2
  Top 0.25: U1.52 28,11.25 27.25,12 27.25,18.25 25.73,19.77 25.72,19.77 23.75,21.74 23.75,23 R12.1
N$3
  Top 0.25: U1.12 36.96,16.75 37.71,17.5 C3.1 R3.1
N$4
  Top 0.25: R4.1 C4.1 38,15.5 37.75,15.75 U1.10
N$5
  Top 0.25: U1.61 32.5,8 32,7.5 32,6.25 32.5,5.75 R11.1 C9.2
N$6
  Top 0.25: C6.1 R6.1 38.21,12.5 36.96,13.74 35.96,13.74 U1.6
N$7
  Top 0.25: C7.1 R7.1 38,10.5 37.75,10.75 37.75,11.96 36.96,12.75 U1.4
N$9
  Top 0.25: R13.1 10.5,24.25 D1.A
N$10
  Top 0.25: 33.25,6.75 R11.2 | U1.63 U1.62 33,8 33.25,7.75 33.25,6.75 | RB.1 36,5.5 34.75,6.75 C9.1 33.25,6.75
N$11
  Top 0.25: R2.1 C2.1 38,19.5 37.5,19 37.5,18 37.25,17.75 U1.14
N$12
  Top 0.25: CN3.4 14.52,24.75 14.52,18.04 U2.23
N$13
  Top 0.25: U5.2 11,6.69 11.5,7.19 C26.1
N$14
  Top 0.25: C5.1 R5.1 38.21,14.5 37.99,14.72 37.96,14.75 U1.8
N$15
  Top 0.25: CN3.2 11.94,27 14,24.94 14,18.23 U2.24
N$16
  Top 0.25: U2.26 12.41,17.59 12,18 12,19.75 13.5,21.25 13.5,23.25 10.75,26 10.75,28.5 11.5,29.25 21.6,29.25 22.1,28.75 CN3.6
N$17
  Top 0.25: C8.1 R8.1 37.75,8.5 37.25,9 37.25,11.46 36.96,11.75 U1.2
N$18  (via drill 0.35 pad 0.35)
  Top 0.25: CN3.5 17.56,25.25 15.75,25.25 15,24.5 15,19.18 v15.18,19 | U2.4 13.25,15.35 v13.25,15.5
  Bottom 0.25: v13.25,15.5 13.25,15.32 15.18,17.25 v15.18,19
N$20
  Top 0.25: U1.18 33.5,22 JP4.1
N$21
  Top 0.25: R12.2 22.85,24.9 20.9,24.9 20.75,24.75 JP1.2
N$22  (via drill 0.35 pad 0.35)
  Top 0.25: U1.37 25.51,16.75 26.09,17.34 v26.09,17.5 | v23.14,19.75 22.89,20 JP3.1
  Bottom 0.25: v26.09,17.5 24,17.5 23.14,18.36 v23.14,19.75
N$23
  Top 0.25: R9.1 D2.A
N$24  (via drill 0.35 pad 0.35)
  Top 0.25: U2.27 11.5,17.81 11.5,19.75 v11.25,20 | v10.75,22 R13.2
  Bottom 0.25: v10.75,22 10.75,20.5 v11.25,20
N$26
  Top 0.25: R10.1 D3.A
N$31
  Top 0.25: U4.2 19.25,6.69 19.75,7.19 C25.1
REF
  Top 0.25: RR.2 42,24.5 43.02,23.48 CN2.1
SCKL
  Top 0.25: 15.5,11.75 15.44,11.75 U2.11 | 15.5,11.75 18.75,11.75 22.25,15.25 U1.40 | 15.5,11.75 TP5.TP
SELECT
  Top 0.25: U2.7 12.39,12.39 11.5,11.5 9.14,11.5 8.25,12.39 8.25,17.54 CN1.9
START
  Top 0.25: U2.19 15.99,16.68 21.18,16.68 21.61,16.25 U1.38 26,16.25 26.75,17 26.75,18 23.38,21.38 | 23.38,21.38 22.75,22 JP2.1 | TP7.TP 23.38,21.38
START_GL  (via drill 0.35 pad 0.35)
  Top 0.25: JP2.2 20.09,21.25 16.25,21.25 v15.75,21.75 | v12,21.75 11.5,21.25 7.08,21.25 CN1.11
  Bottom 0.25: v12,21.75 12.5,22.25 15.25,22.25 v15.75,21.75
UART_CLK
  Top 0.25: U2.10 14.5,11.98 14.5,11.5 13,10 6.25,10 5.75,10.5 5.75,15.75 6.27,16.27 CN1.7
UART_RX
  Top 0.25: U2.9 12.19,10.5 7.67,10.5 CN1.3
UART_TX
  Top 0.25: U2.8 11.72,11 9,11 6.97,13.03 CN1.5
V+  (via drill 0.35 pad 0.35)
  Top 0.25: 17.6,5.15 C24.1 17.88,4.87 U4.4 18.75,4.25 19,4 19.5,4 19.75,4.25 U4.6 | C23.1 9.5,5.5 10.13,4.87 U5.4 10.5,4.25 10.75,4 11.25,4 11.5,4.25 U5.6
  Top 0.5: v7.75,5.5 C23.1 v9,4.25 | v17.25,4.25 C24.1 v16,5.5
  Top 0.74: C23.1
  pour Route15 (isolate 0.5): 22.5,6.25 22.5,0 0,0 0,10 8,10 11.75,6.25
VCAP1
  Top 0.25: U1.28 C10.1
VCAP2
  Top 0.25: U1.30 27.5,22 26.5,23 C11.1
VCAP3
  Top 0.25: U1.55 29.5,8 29.75,7.75 C13.1 30.75,6.75 C12.1
VCAP4
  Top 0.25: U1.26 29.5,22 30.5,23 C14.1
VREFP
  Top 0.25: U1.24 30.5,21.75 31.75,23 C15.1 32.75,23.25 C16.1
VREFX  (via drill 0.35 pad 0.35)
  Top 0.25: U1.17 34.18,20.68 37,23.5 JP4.2 RR.1 38.5,24 39,23.5 v40.5,23.5 | C3.2 v40.5,17.5 | C2.2 v40.5,19.5 | C4.2 v40.5,15.5 | C5.2 v40.5,13.5 | C6.2 v40.5,11.5 | v40.5,9.5 C7.2 | v40.5,7.5 C8.2 | C1.2 v40.5,21.5
  pour Route15 (rank 3): 39.5,25 39.5,7 41,7 41,25

### Text on the board
tPlace: R-12345678B--- | ACT | R | C | G | S | 1 | CS | 2 | 3 | CK | 4 | 5 | TX | 6 | 7 | RX | 8 | B | V | G | REV A | 3.3V | 5.0V | TK stEEG
bPlace: VDD | SWCLK | GND | SWDIO | NRST | SWO | ST | GND | CK | REF | B0 | CS | CH1 | CH2 | CLK | CH4 | GND | CH3 | TX | CH6 | GND | CH5 | GND | RX | CH7 | CH8 | V+ | GND | GND | BIAS